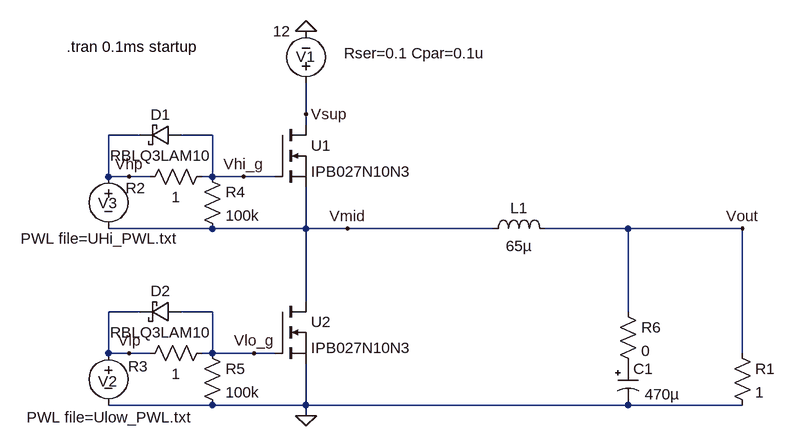
[diagram p0: schematic MOSFET_Heat_Sim_PWL_IPB027N10N3.asc]
MOSFET_Heat_Sim_PWL_IPB027N10N3.asc, the LTspice schematic file:
Version 4
SHEET 1 1568 680
WIRE 240 -160 240 -208
WIRE 240 -144 240 -160
WIRE -16 -128 -64 -128
WIRE 96 -128 48 -128
WIRE -64 -64 -64 -128
WIRE -32 -64 -64 -64
WIRE 0 -64 -32 -64
WIRE 96 -64 96 -128
WIRE 96 -64 80 -64
WIRE 144 -64 96 -64
WIRE 192 -64 144 -64
WIRE 96 16 -64 16
WIRE 240 16 240 -48
WIRE 240 16 96 16
WIRE 304 16 240 16
WIRE 528 16 304 16
WIRE 736 16 608 16
WIRE 912 16 736 16
WIRE 240 128 240 16
WIRE -16 144 -64 144
WIRE 96 144 48 144
WIRE 736 144 736 16
WIRE -64 208 -64 144
WIRE -32 208 -64 208
WIRE 0 208 -32 208
WIRE 96 208 96 144
WIRE 96 208 80 208
WIRE 160 208 96 208
WIRE 192 208 160 208
WIRE 912 208 912 16
WIRE 96 288 -64 288
WIRE 240 288 240 224
WIRE 240 288 96 288
WIRE 736 288 240 288
WIRE 912 288 736 288
WIRE 240 304 240 288
FLAG 240 304 0
FLAG 240 -288 0
FLAG 912 16 Vout
FLAG 144 -64 Vhi_g
FLAG 160 208 Vlo_g
FLAG 304 16 Vmid
FLAG -32 -64 Vhp
FLAG -32 208 Vlp
FLAG 240 -160 Vsup
SYMBOL res 896 192 R0
SYMATTR InstName R1
SYMATTR Value 1
SYMBOL voltage 240 -192 R180
WINDOW 123 0 0 Left 0
WINDOW 39 -278 62 Left 2
WINDOW 0 -14 57 Left 2
SYMATTR SpiceLine Rser=0.1 Cpar=0.1u
SYMATTR InstName V1
SYMATTR Value 12
SYMBOL voltage -64 192 R0
WINDOW 3 -126 115 Left 2
WINDOW 123 0 0 Left 0
WINDOW 39 0 0 Left 0
WINDOW 0 -16 59 Left 2
SYMATTR Value PWL file=Ulow_PWL.txt
SYMATTR InstName V2
SYMBOL res 96 -80 R90
WINDOW 0 49 118 VBottom 2
WINDOW 3 32 56 VTop 2
SYMATTR InstName R2
SYMATTR Value 1
SYMBOL res 96 192 R90
WINDOW 0 52 114 VBottom 2
WINDOW 3 32 56 VTop 2
SYMATTR InstName R3
SYMATTR Value 1
SYMBOL res 80 -80 R0
SYMATTR InstName R4
SYMATTR Value 100k
SYMBOL res 80 192 R0
SYMATTR InstName R5
SYMATTR Value 100k
SYMBOL polcap 720 224 R0
WINDOW 3 42 47 Left 2
SYMATTR Value 470µ
SYMATTR InstName C1
SYMATTR Description Capacitor
SYMATTR Type cap
SYMATTR SpiceLine V=100 Irms=1.88 Rser=0.013 Lser=6.47n mfg="Würth Elektronik" pn="860040880011 WCAP-ATUL 16x35,5" type="Al electrolytic"
SYMBOL res 720 128 R0
SYMATTR InstName R6
SYMATTR Value 0
SYMBOL ind 512 32 R270
WINDOW 0 32 56 VTop 2
WINDOW 3 5 56 VBottom 2
SYMATTR InstName L1
SYMATTR Value 65µ
SYMATTR SpiceLine Ipk=17.2 Rser=0.01313 Rpar=21316 Cpar=20.57p mfg="Würth Elektronik" pn="7443783533650 WE-HCFT 3533"
SYMBOL voltage -64 -80 R0
WINDOW 3 -135 111 Left 2
WINDOW 123 0 0 Left 0
WINDOW 39 0 0 Left 0
WINDOW 0 -16 57 Left 2
SYMATTR Value PWL file=UHi_PWL.txt
SYMATTR InstName V3
SYMBOL schottky 48 -144 R90
WINDOW 0 0 32 VBottom 2
WINDOW 3 32 32 VTop 2
SYMATTR InstName D1
SYMATTR Value RBLQ3LAM10
SYMATTR Description Diode
SYMATTR Type diode
SYMBOL schottky 48 128 R90
WINDOW 0 0 32 VBottom 2
WINDOW 3 32 32 VTop 2
SYMATTR InstName D2
SYMATTR Value RBLQ3LAM10
SYMATTR Description Diode
SYMATTR Type diode
SYMBOL nmos 192 128 R0
SYMATTR InstName U2
SYMATTR Value IPB027N10N3
SYMBOL nmos 192 -144 R0
SYMATTR InstName U1
SYMATTR Value IPB027N10N3
TEXT -128 -264 Left 2 !.tran 0.1ms startup

The netlist it stands for:
* MOSFET_Heat_Sim_PWL_IPB027N10N3.asc
R1 Vout 0 1
V1 Vsup 0 12 Rser=0.1 Cpar=0.1u
V2 Vlp 0 PWL file=Ulow_PWL.txt
R2 Vhi_g Vhp 1
R3 Vlo_g Vlp 1
R4 Vhi_g Vmid 100k
R5 Vlo_g 0 100k
C1 P001 0 470µ V=100 Irms=1.88 Rser=0.013 Lser=6.47n mfg="Würth Elektronik" pn="860040880011 WCAP-ATUL 16x35,5" type="Al electrolytic"
R6 Vout P001 0
L1 Vmid Vout 65µ Ipk=17.2 Rser=0.01313 Rpar=21316 Cpar=20.57p mfg="Würth Elektronik" pn="7443783533650 WE-HCFT 3533"
V3 Vhp Vmid PWL file=UHi_PWL.txt
D1 Vhi_g Vhp RBLQ3LAM10
D2 Vlo_g Vlp RBLQ3LAM10
M§U2 Vmid Vlo_g 0 0 IPB027N10N3
M§U1 Vsup Vhi_g Vmid Vmid IPB027N10N3
.model D D
.lib standard.dio
.model NMOS NMOS
.model PMOS PMOS
.lib standard.mos
.tran 0.1ms startup
.backanno
.end